# Altium schematic sheet Button.SchDoc
size 420 x 297 mm; Address1: Address1; Address2: Address2; Address3: Address3; Address4: Address4; DocumentNumber: *Э3; SheetNumber: 5; SheetTotal: 12; DocumentType: Схема электрическая *
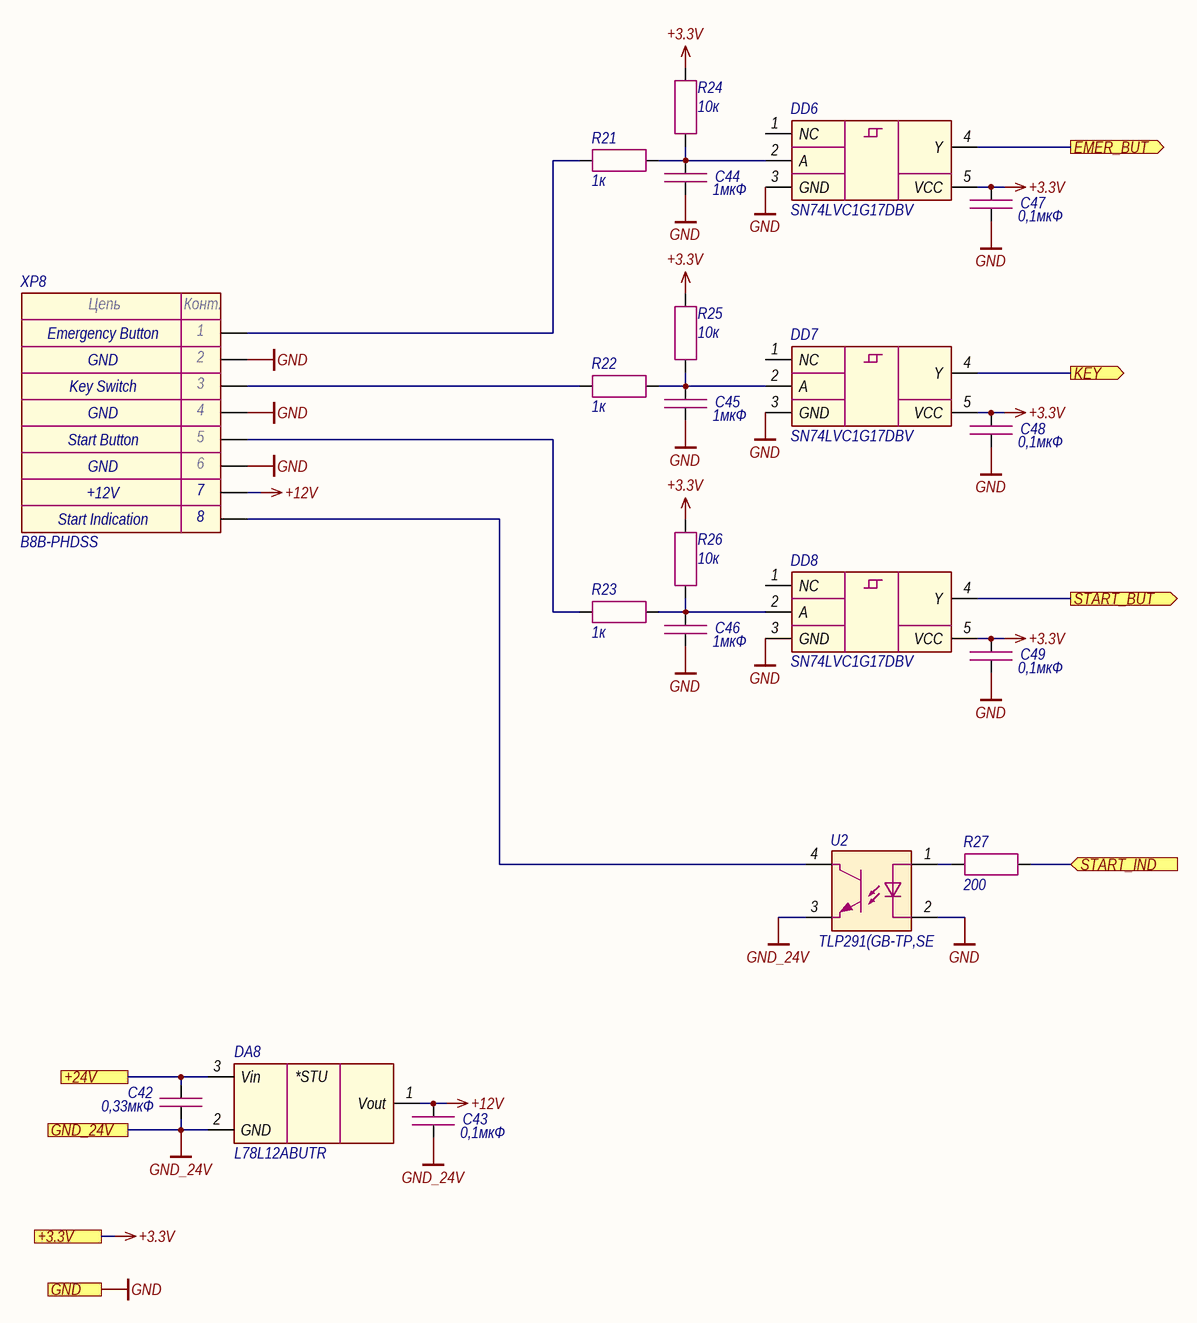
[diagram p0: Button.SchDoc]

## Parts
C42  0,33мкФ  [CAP_0805]
C43  0,1мкФ  [CAP_0603]
C44  1мкФ  [CAP_0603]
C45  1мкФ  [CAP_0603]
C46  1мкФ  [CAP_0603]
C47  0,1мкФ  [CAP_0603]
C48  0,1мкФ  [CAP_0603]
C49  0,1мкФ  [CAP_0603]
DA8  L78L12ABUTR  [SOT-89]
DD6  SN74LVC1G17DBV  [SOT-23-5]
DD7  SN74LVC1G17DBV  [SOT-23-5]
DD8  SN74LVC1G17DBV  [SOT-23-5]
R21  1к  [RES_0603]
R22  1к  [RES_0603]
R23  1к  [RES_0603]
R24  10к  [RES_0603]
R25  10к  [RES_0603]
R26  10к  [RES_0603]
R27  200  [RES_0603]
U2  TLP291(GB-TP,SE  [11-3C1]
XP8  B8B-PHDSS  [B8B-PHDSS]

## Ports
+3.3V (see Main[1B], Bus[1D], Ethernet[3D], Fiber_interlock[2C], Flow_sensor[2C], Hardwiring[3D]), +24V (see Main[1B], Bus[1D], Column[1C], Flow_sensor[2C], Hardwiring[3C], Indication[1C]), EMER_BUT (out, see Main[2B]), GND (see Main[1B], Bus[1D], Column[1C], Ethernet[3D], Fiber_interlock[2C], Flow_sensor[2C], Guide_laser[1C], Hardwiring[3D], Indication[1C]), GND_24V (see Main[1B], Bus[1D], Column[1C], Flow_sensor[2C], Hardwiring[3C], Indication[1C]), KEY (out, see Main[2B]), START_BUT (out, see Main[2B]), START_IND (in, see Main[2B])

## Nets
+3.3V: C47.1 C48.1 C49.1 DD6.5(VCC) DD7.5(VCC) DD8.5(VCC) R24.2 R25.2 R26.2 ; port +3.3V
+12V: C43.1 DA8.1(Vout) XP8.7
GND: C44.2 C45.2 C46.2 C47.2 C48.2 C49.2 DD6.3(GND) DD7.3(GND) DD8.3(GND) U2.2 XP8.2 XP8.4 XP8.6 ; port GND
GND_24V: C42.1 C43.2 DA8.2(GND) U2.3 ; port GND_24V
+24V: C42.2 DA8.3(Vin) ; port +24V
EMER_BUT: DD6.4(Y) ; port EMER_BUT
KEY: DD7.4(Y) ; port KEY
START_BUT: DD8.4(Y) ; port START_BUT
START_IND: R27.2 ; port START_IND
NetC44_1: C44.1 DD6.2(A) R21.2 R24.1
NetC45_1: C45.1 DD7.2(A) R22.2 R25.1
NetC46_1: C46.1 DD8.2(A) R23.2 R26.1
NetR21_1: R21.1 XP8.1
NetR22_1: R22.1 XP8.3
NetR23_1: R23.1 XP8.5
NetR27_1: R27.1 U2.1
NetU2_4: U2.4 XP8.8

Not connected (* = marked no-connect by the designer): DD6 1(NC); DD7 1(NC); DD8 1(NC)

## Notes on the sheet
- GND
- (near XP8) Emergency Button
- Start Button
- Key Switch
- +12V
- (near XP8) Start Indication
- Подп. и дата
- Инв. № дубл.
- Взам. инв. №
- Инв. № подл.
- Изм.
- Лист
- № докум.
- Подп.
- Дата
- Копировал
- Формат А3
- (in symbol Connector-8) Цепь; Конт.
- (in symbol LD2981ABU50TR) *STU

## Library data of the parts
C42 = Capacitor: Manufacturer: Murata; Model: GRM219R71H334KA88D; Value: 0,33мкФ; Document: *
C43 C47-C49 = Capacitor: Manufacturer: Murata; Model: GRM188R71H104KA93D; Value: 0,1мкФ; Document: *
C44-C46 = Capacitor: Manufacturer: Murata; Model: GRM188R61H105KAALD; Value: 1мкФ; Document: *
DA8 = LD2981ABU50TR: Manufacturer: STMicroelectronics; Model: L78L12ABUTR; Document: *
DD6-DD8 = SN74LVC1G17: Manufacturer: Texas Instruments; Model: SN74LVC1G17DBV; Document: *
R21-R23 = Resistor: Manufacturer: Yageo; Model: RC0603FR-071KL; Value: 1к; Document: *
R24-R26 = Resistor: Manufacturer: Yageo; Model: RC0603FR-0710KL; Value: 10к; Document: *
R27 = Resistor: Manufacturer: Yageo; Model: RC0603FR-07200RL; Value: 200; Document: *
U2 = TLP291: Manufacturer: Toshiba; Model: TLP291(GB-TP,SE; Document: *
XP8 = Connector-8: Manufacturer: JST; Model: B8B-PHDSS; Document: *